# Altium schematic sheet 16-MT7688AN Power-F.SchDoc
size A4
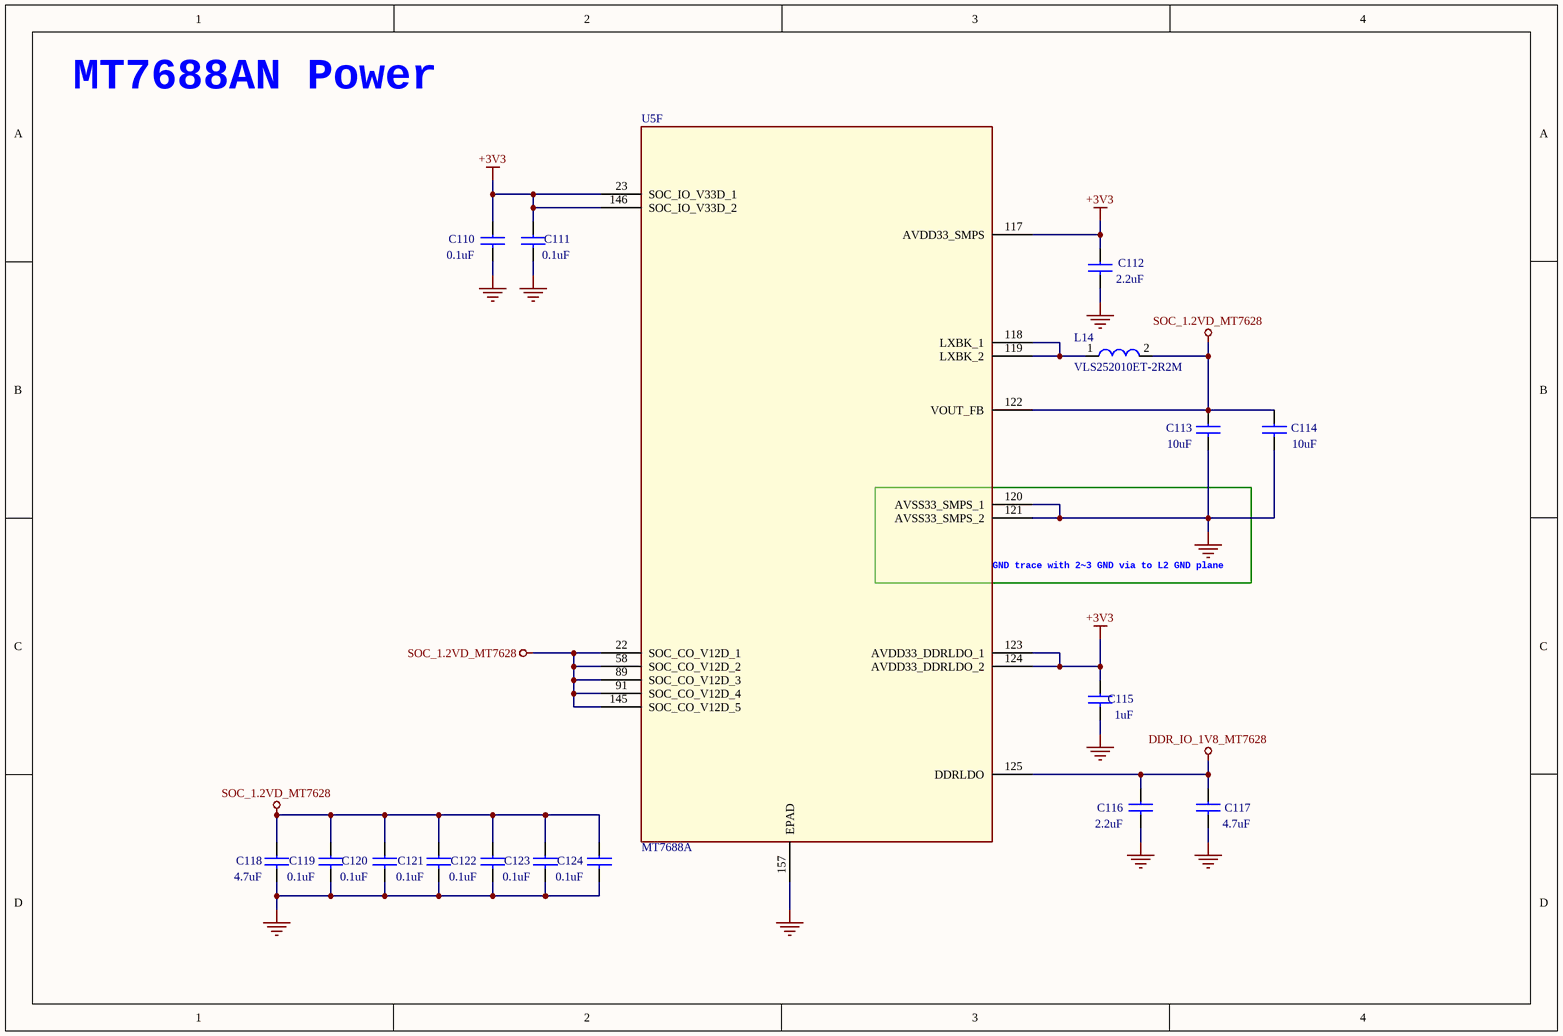
[diagram p0: 16-MT7688AN Power-F.SchDoc]

## Parts
C110  0.1uF  [CAPC1005X55X25NL05T10]
C111  0.1uF  [CAPC1005X55X25NL05T10]
C112  2.2uF  [CAPC1608X90X35NL10T15]
C113  10uF  [CAPC1608X90X35NL10T15]
C114  10uF  [CAPC1608X90X35NL10T15]
C115  1uF  [CAPC1608X90X35NL10T15]
C116  2.2uF  [CAPC1608X90X35NL10T15]
C117  4.7uF  [CAPC1005X55X25NL05T10]
C118  4.7uF  [CAPC1005X55X25NL05T10]
C119  0.1uF  [CAPC1005X55X25NL05T10]
C120  0.1uF  [CAPC1005X55X25NL05T10]
C121  0.1uF  [CAPC1005X55X25NL05T10]
C122  0.1uF  [CAPC1005X55X25NL05T10]
C123  0.1uF  [CAPC1005X55X25NL05T10]
C124  0.1uF  [CAPC1005X55X25NL05T10]
L14  VLS252010ET-2R2M  [VLS252010/TDK INDUCTOR]
U5  MT7688A  [MT7628AN$2F$DRQFN156$2F$SMD$2F$P0.5$2F$12X12]  (part F of 6)

## Nets
+3V3: C110.1 C111.1 C112.1 C115.1 U5.23(SOC_IO_V33D_1) U5.117(AVDD33_SMPS) U5.123(AVDD33_DDRLDO_1) U5.124(AVDD33_DDRLDO_2) U5.146(SOC_IO_V33D_2)
DDR_IO_1V8_MT7628: C116.1 C117.1 U5.125(DDRLDO)
GND: C110.2 C111.2 C112.2 C113.2 C114.2 C115.2 C116.2 C117.2 C118.2 C119.2 C120.2 C121.2 C122.2 C123.2 C124.2 U5.120(AVSS33_SMPS_1) U5.121(AVSS33_SMPS_2) U5.157(EPAD)
SOC_1.2VD_MT7628: C113.1 C114.1 C118.1 C119.1 C120.1 C121.1 C122.1 C123.1 C124.1 L14.2 U5.22(SOC_CO_V12D_1) U5.58(SOC_CO_V12D_2) U5.89(SOC_CO_V12D_3) U5.91(SOC_CO_V12D_4) U5.122(VOUT_FB) U5.145(SOC_CO_V12D_5)
NetL14_1: L14.1 U5.118(LXBK_1) U5.119(LXBK_2)

## Notes on the sheet
- MT7688AN Power
- (near U5) GND trace with 2~3 GND via to L2 GND plane

## Library data of the parts
C110-C124 = CAP NP
L14 = L/0402: IND 0805 METAL 2.2uH 0.19R 1.2A T=1.0mm
U5 = MT7620N-n_26